# EAGLE schematic Becca Sap Flow Sensor OG (EAGLE 9.6.2)
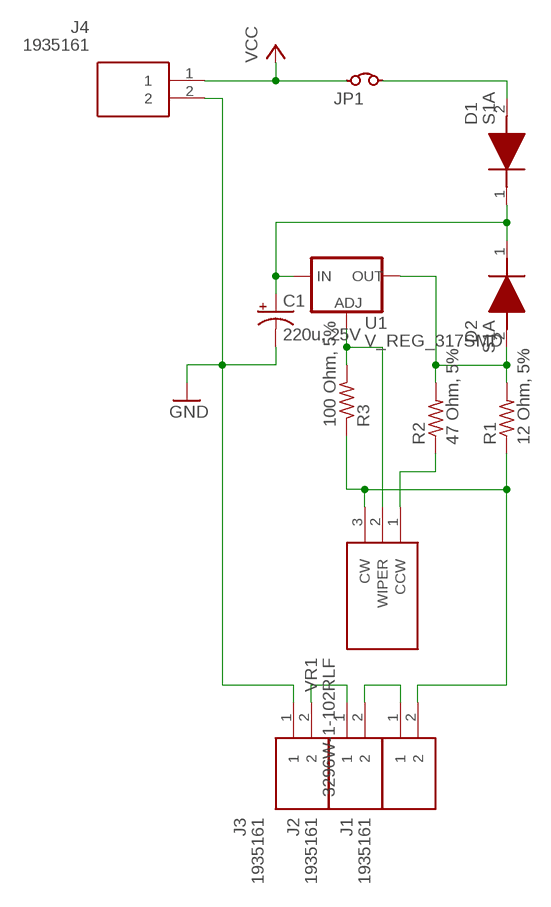
[diagram p0: schematic, sheet 1]

## Parts
C1  220u, 25V  CPOL-USC  [PANASONIC_C]
D1  S1A  [DIOM5027X250N]
D2  S1A  [DIOM5027X250N]
J1  1935161  [1935161]
J2  1935161  [1935161]
J3  1935161  [1935161]
J4  1935161  [1935161]
JP1  JUMPER  [HDR2X1]
R1  12 Ohm, 5%  R-US_R0805  [R0805]
R2  47 Ohm, 5%  R-US_R0805  [R0805]
R3  100 Ohm, 5%  R-US_R0805  [R0805]
U1  V_REG_317SMD  [SOT223]
VR1  3296W-1-102RLF  [3296W1102RLF]

## Nets
GND: C1.- J3.1 J4.2
N$1: D1.2(A) JP1.2
N$2: C1.+ D1.1(K) D2.1(K) U1.3(IN)
N$4: D2.2(A) R1.2 R2.2 U1.2(OUT)
N$5: J2.1 J3.2
N$6: J1.1 J2.2
N$9: R3.2 U1.1(ADJ) VR1.2(WIPER)
N$10: R2.1 VR1.1(CCW)
N$11: J1.2 R1.1 R3.1 VR1.3(CW)
VCC: J4.1 JP1.1

## Library data of the parts
C1 = rcl:CPOL-US: POLARIZED CAPACITOR, American symbol; SPICEPREFIX: C
D1 D2 = S1A:S1A: Rectifier Diode Switching 50V 1A 1500ns 2-Pin SMA T/R Source: Datasheet <https://diotec.com/request/datasheet/s1a.pdf>; DESCRIPTION: Rectifier Diode Switching 50V 1A 1500ns 2-Pin SMA T/R; HEIGHT: 2.5mm; MANUFACTURER_NAME: Diotec; MANUFACTURER_PART_NUMBER: S1A; MOUSER_PART_NUMBER: 637-S1A; MOUSER_PRICE-STOCK: https://www.mouser.co.uk/ProductDetail/Diotec-Semiconductor/S1A?qs=OlC7AqGiEDlqVjQP70PTqA%3D%3D
J1-J4 = 1935161:1935161: Phoenix Contact COMBICON PT PCB Terminal Block, 2 Way/Pole, Screw Terminals, 26 14 AWG Through Hole, Nylon Source: Datasheet <https://datasheet.datasheetarchive.com/originals/distributors/SFDatasheet-2/sf-00057459.pdf>; DESCRIPTION: Phoenix Contact COMBICON PT PCB Terminal Block, 2 Way/Pole, Screw Terminals, 26 14 AWG Through Hole, Nylon; HEIGHT: 11.55mm; MANUFACTURER_NAME: Phoenix Contact; MANUFACTURER_PART_NUMBER: 1935161; MOUSER_PART_NUMBER: 651-1935161; MOUSER_PRICE-STOCK: https://www.mouser.co.uk/ProductDetail/Phoenix-Contact/1935161?qs=W3wJikR1%252BS6eKzfFl8Rbew%3D%3D
JP1 = 6P1_EVB:JUMPER: Wire jumper .1" C
R1-R3 = rcl:R-US_: RESISTOR, American symbol; SPICEPREFIX: R
U1 = SparkFun-IC-Power:V_REG_317: Voltage Regulator Standard LM317 adjustable voltage regulator. AOI (Adjust Output Input). Google 'LM317 Calculator' for easy to use app to get the two resistor values needed. 240/720 for 5V output. 240/390 for 3.3V output. Spark Fun Electronics SKU : COM-00527
VR1 = 3296W-1-102RLF:3296W-1-102RLF: 1 kOhms 0.5W, 1/2W PC Pins Through Hole Trimmer Potentiometer Cermet 25.0 Turn Top Adjustment Source: Datasheet <https://www.bourns.com/docs/Product-Datasheets/3296.pdf>; DESCRIPTION: 1 kOhms 0.5W, 1/2W PC Pins Through Hole Trimmer Potentiometer Cermet 25.0 Turn Top Adjustment; HEIGHT: 11.8mm; MANUFACTURER_NAME: Bourns; MANUFACTURER_PART_NUMBER: 3296W-1-102RLF; MOUSER_PART_NUMBER: 652-3296W-1-102RLF; MOUSER_PRICE-STOCK: https://www.mouser.co.uk/ProductDetail/Bourns/3296W-1-102RLF?qs=oM%2FE6%2FUWOpR5bwX1MfrWeA%3D%3D